# Altium schematic sheet micro.SchDoc
size A3
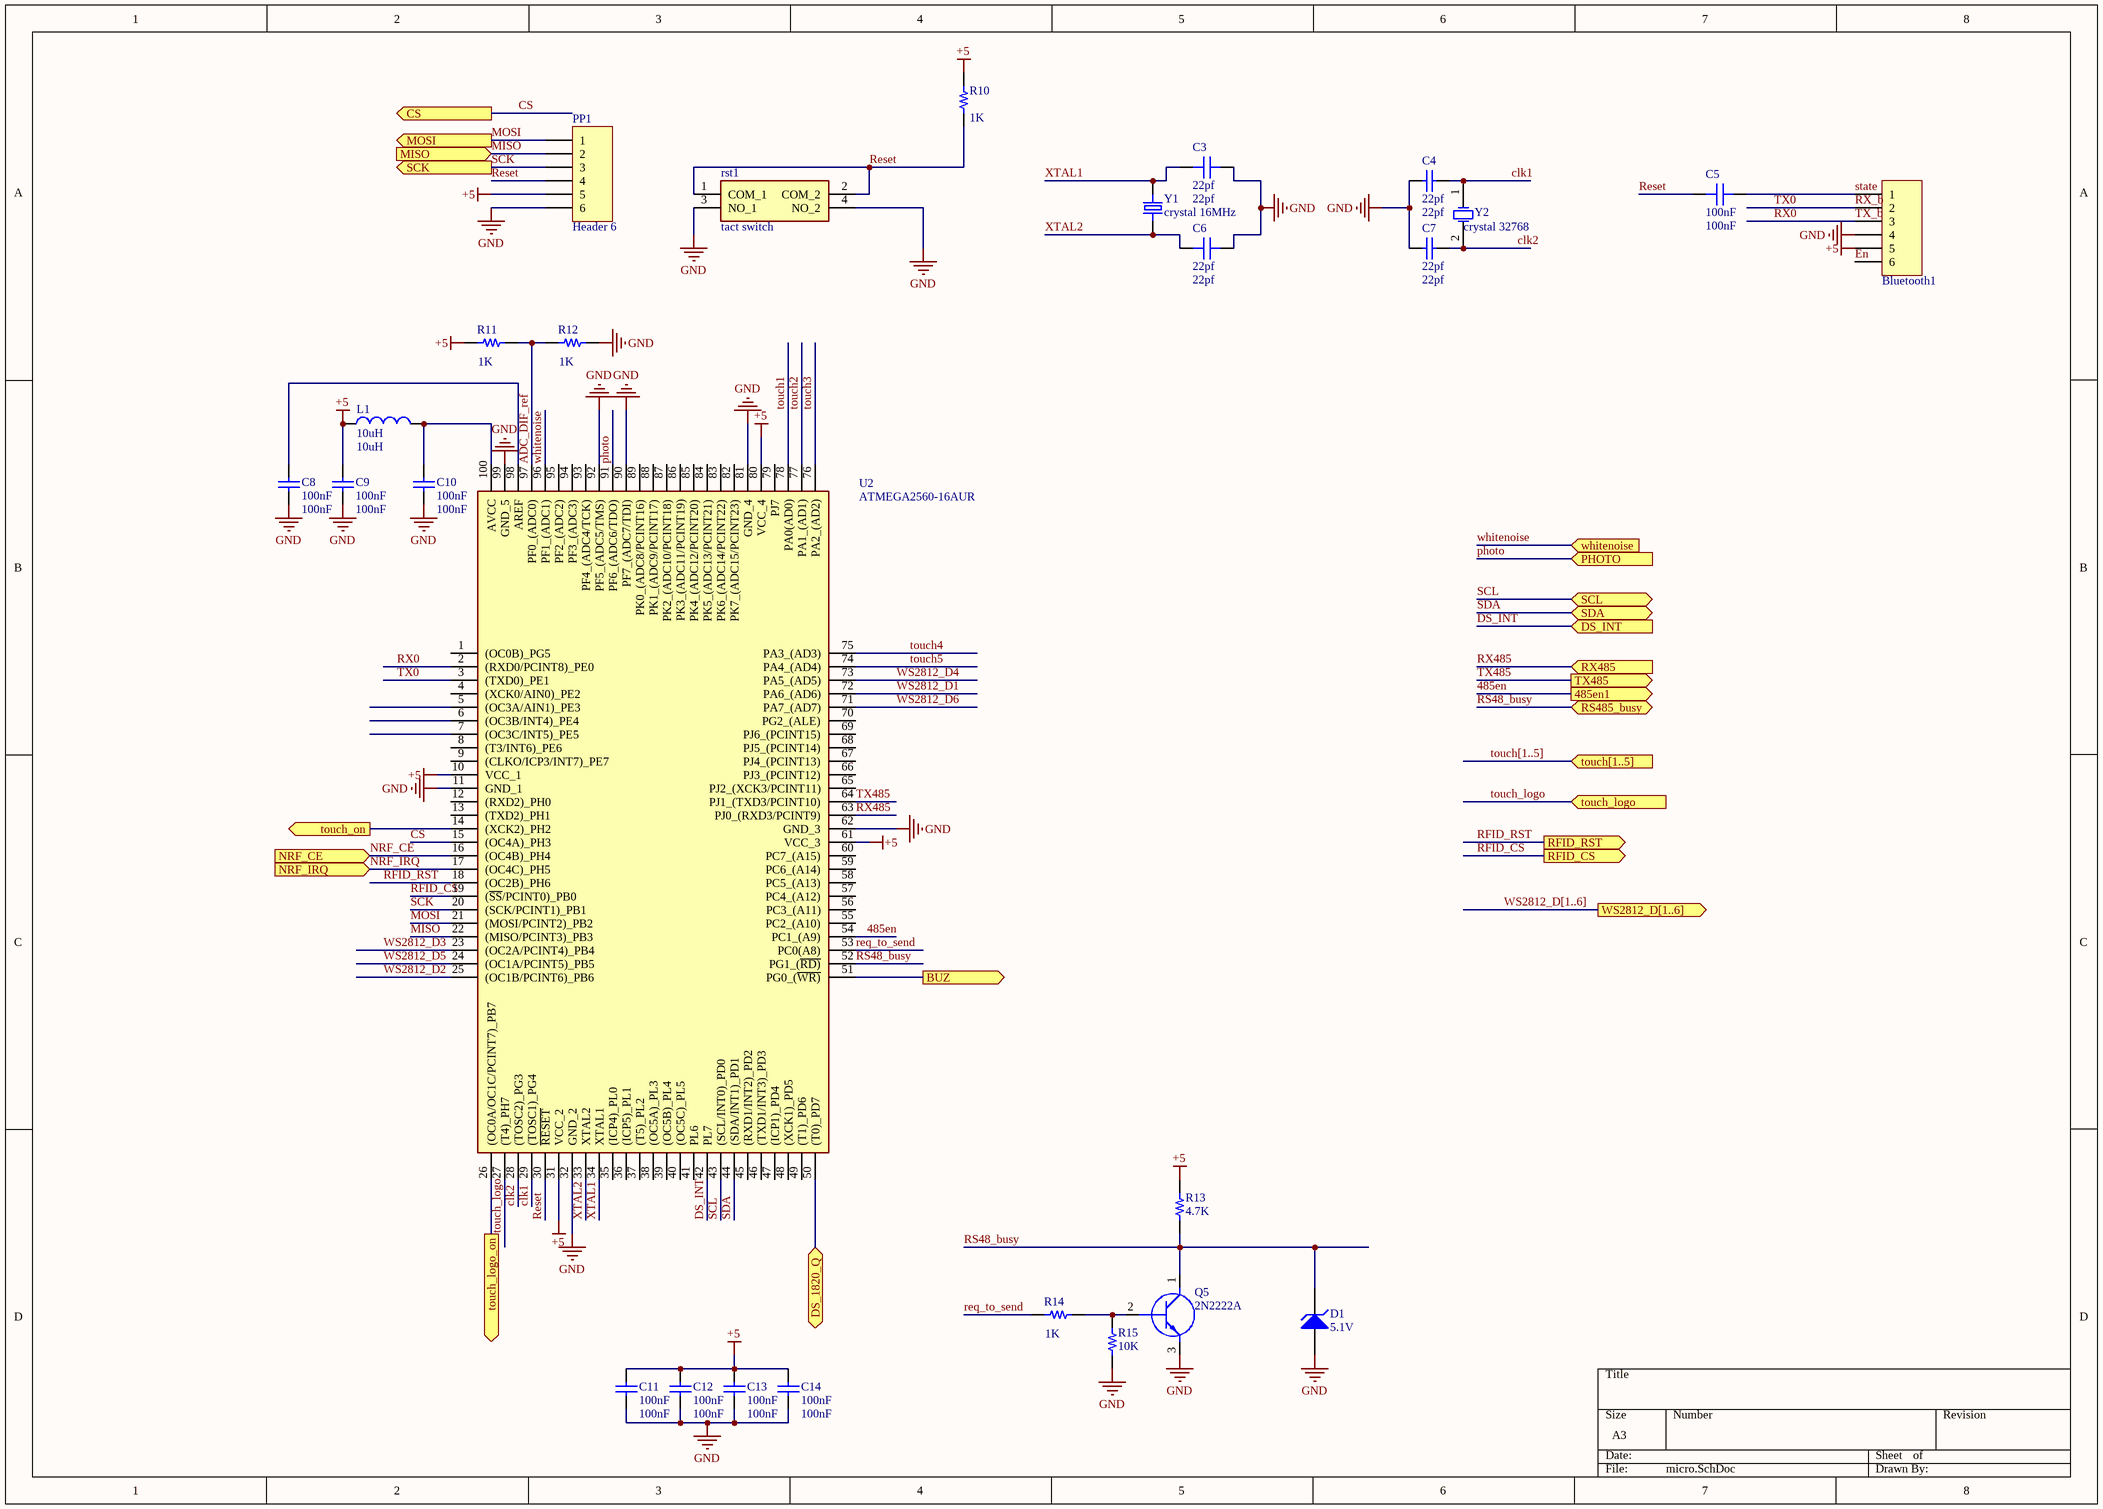
[diagram p0: micro.SchDoc]

## Parts
Bluetooth1  Header 6  [H-1x6]  (value not drawn)
C3  22pf  [0603C]
C4  22pf  [0603C]
C5  100nF  [0603C]
C6  22pf  [0603C]
C7  22pf  [0603C]
C8  100nF  [0603C]
C9  100nF  [0603C]
C10  100nF  [0603C]
C11  100nF  [0603C]
C12  100nF  [0603C]
C13  100nF  [0603C]
C14  100nF  [0603C]
D1  5.1V  [Diode 1n4148 SMD]
L1  10uH  [IND1206]
PP1  Header 6  [HDR1X6]
Q5  2N2222A  [soT95p280x130-3n]
R10  1K  [0603R]
R11  1K  [0603R]
R12  1K  [0603R]
R13  4.7K  [0603R]
R14  1K  [0603R]
R15  10K  [0603R]
rst1  tact switch  [DTSM63NVB]
U2  ATMEGA2560-16AUR  [QFP50P1600X1600X120-100N]
Y1  crystal 16MHz  [XTAL_ECS-180-S-5P-DN-TR]
Y2  crystal 32768  [XTAL RTC]

## Ports
485en1 (out), BUZ (out), CS (out), DS_1820_Q (bidir), DS_INT (in), MISO (in), MOSI (out), NRF_CE (in), NRF_IRQ (in), PHOTO (in), RFID_CS (out), RFID_RST (out), RS485_busy (bidir), RX485 (in), SCK (out), SCL (bidir), SDA (bidir), touch[1..5] (in), touch_logo (in), touch_logo_on (out), touch_on (out), TX485 (out), whitenoise (in), WS2812_D[1..6] (out)

## Nets
+5: Bluetooth1.5 C9.1 C11.1 C12.1 C13.1 C14.1 L1.1 PP1.5 R10.2 R11.2 R13.1 U2.10(VCC_1) U2.31(VCC_2) U2.61(VCC_3) U2.80(VCC_4)
GND: Bluetooth1.4 C3.1 C4.1 C6.1 C7.2 C8.2 C9.2 C10.2 C11.2 C12.2 C13.2 C14.2 D1.1(A) PP1.6 Q5.3(E) R12.1 R15.2 rst1.3(NO_1) rst1.4(NO_2) U2.11(GND_1) U2.32(GND_2) U2.62(GND_3) U2.81(GND_4) U2.90(PF7_(ADC7/TDI)) U2.92(PF5_(ADC5/TMS)) U2.99(GND_5)
485en: U2.54(PC1_(A9)) ; port 485en1
ADC_DIF_ref: R11.1 R12.2 U2.97(PF0_(ADC0))
BUZ: U2.51(PG0_(~{WR)}) ; port BUZ
clk1: C4.2 U2.29((TOSC1)_PG4) Y2.1(OSC1)
clk2: C7.1 U2.28((TOSC2)_PG3) Y2.2(OSC2)
CS: U2.15((OC4A)_PH3) ; port CS
DS_1820_Q: U2.50((T0)_PD7) ; port DS_1820_Q
DS_INT: U2.42(PL7) ; port DS_INT
En: Bluetooth1.6
MISO: PP1.2 U2.22((MISO/PCINT3)_PB3) ; port MISO
MOSI: PP1.1 U2.21((MOSI/PCINT2)_PB2) ; port MOSI
NRF_CE: U2.16((OC4B)_PH4) ; port NRF_CE
NRF_IRQ: U2.17((OC4C)_PH5) ; port NRF_IRQ
photo: U2.91(PF6_(ADC6/TDO)) ; port PHOTO
req_to_send: R14.2 U2.53(PC0(A8))
Reset: C5.2 PP1.4 R10.1 rst1.1(COM_1) rst1.2(COM_2) U2.30(~{RESET})
RFID_CS: U2.19((~{SS}/PCINT0)_PB0) ; port RFID_CS
RFID_RST: U2.18((OC2B)_PH6) ; port RFID_RST
RS48_busy: D1.2(K) Q5.1(C) R13.2 U2.52(PG1_(~{RD)}) ; port RS485_busy
RX0: Bluetooth1.3 U2.2((RXD0/PCINT8)_PE0)  [also labelled TX_b]
RX485: U2.63(PJ0_(RXD3/PCINT9)) ; port RX485
RX_b: Bluetooth1.2 U2.3((TXD0)_PE1)  [also labelled TX0]
SCK: PP1.3 U2.20((SCK/PCINT1)_PB1) ; port SCK
SCL: U2.43((SCL/INT0)_PD0) ; port SCL
SDA: U2.44((SDA/INT1)_PD1) ; port SDA
state: Bluetooth1.1 C5.1
touch1: U2.78(PA0(AD0))
touch2: U2.77(PA1_(AD1))
touch3: U2.76(PA2_(AD2))
touch4: U2.75(PA3_(AD3))
touch5: U2.74(PA4_(AD4))
touch_logo: U2.27((T4)_PH7) ; port touch_logo
touch_logo_on: U2.26((OC0A/OC1C/PCINT7)_PB7) ; port touch_logo_on
touch_on: U2.14((XCK2)_PH2) ; port touch_on
TX485: U2.64(PJ1_(TXD3/PCINT10)) ; port TX485
whitenoise: U2.96(PF1_(ADC1)) ; port whitenoise
WS2812_D1: U2.72(PA6_(AD6))
WS2812_D2: U2.25((OC1B/PCINT6)_PB6)
WS2812_D3: U2.23((OC2A/PCINT4)_PB4)
WS2812_D4: U2.73(PA5_(AD5))
WS2812_D5: U2.24((OC1A/PCINT5)_PB5)
WS2812_D6: U2.71(PA7_(AD7))
XTAL1: C3.2 U2.34(XTAL1) Y1.2
XTAL2: C6.2 U2.33(XTAL2) Y1.1
NetC8_1: C8.1 U2.98(AREF)
NetC10_1: C10.1 L1.2 U2.100(AVCC)
NetQ5_2: Q5.2(B) R14.1 R15.1

Not connected (* = marked no-connect by the designer): U2 1((OC0B)_PG5) 4((XCK0/AIN0)_PE2) 5((OC3A/AIN1)_PE3) 6((OC3B/INT4)_PE4) 7((OC3C/INT5)_PE5) 8((T3/INT6)_PE6) 9((CLKO/ICP3/INT7)_PE7) 12((RXD2)_PH0) 13((TXD2)_PH1) 35((ICP4)_PL0) 36((ICP5)_PL1) 37((T5)_PL2) 38((OC5A)_PL3) 39((OC5B)_PL4) 40((OC5C)_PL5) 41(PL6) 45((RXD1/INT2)_PD2) 46((TXD1/INT3)_PD3) 47((ICP1)_PD4) 48((XCK1)_PD5) 49((T1)_PD6) 55(PC2_(A10)) 56(PC3_(A11)) 57(PC4_(A12)) 58(PC5_(A13)) 59(PC6_(A14)) 60(PC7_(A15)) 65(PJ2_(XCK3/PCINT11)) 66(PJ3_(PCINT12)) 67(PJ4_(PCINT13)) 68(PJ5_(PCINT14)) 69(PJ6_(PCINT15)) 70(PG2_(ALE)) 79(PJ7) 82(PK7_(ADC15/PCINT23)) 83(PK6_(ADC14/PCINT22)) 84(PK5_(ADC13/PCINT21)) 85(PK4_(ADC12/PCINT20)) 86(PK3_(ADC11/PCINT19)) 87(PK2_(ADC10/PCINT18)) 88(PK1_(ADC9/PCINT17)) 89(PK0_(ADC8/PCINT16)) 93(PF4_(ADC4/TCK)) 94(PF3_(ADC3)) 95(PF2_(ADC2))

## Buses and harness runs
bus touch[1..5] = port touch[1..5]
bus WS2812_D[1..6] = port WS2812_D[1..6]

## Library data of the parts
Bluetooth1 = H-1x6: Header, 6-Pin , female
C3 C5 C6 = Capacitor: CAP SMD 0603; Part Number: C0805X106K9RAC7800
  C3 C6: Value: 22pf
  C5: Value: 100nF
C4 C7-C14 = Cap: CAP SMD 0603; Published: 8-Jun-2000; LatestRevisionDate: 17-Jul-2002; LatestRevisionNote: Re-released for DXP Platform.; PackageReference: RAD-0.3; Publisher: Altium Limited; PackageDescription: Radial Cap, Thru-Hole; 2 Leads; 0.3 in Pin Spacing
  C4 C7: Value: 22pf
  C8-C14: Value: 100nF
D1 = D Zener: Zener Diode 5.1v; Published: 8-Jun-2000; LatestRevisionDate: 17-Jul-2002; LatestRevisionNote: Re-released for DXP Platform.; PackageReference: DIODE-0.7; Publisher: Altium Limited; PackageDescription: Diode, Thru-Hole; 2 Leads; 0.7 in Pin Spacing
L1 = Inductor: Inductor 1206; Code_IEC: 1005; Published: 8-Jun-2000; LatestRevisionDate: 29-May-2009; LatestRevisionNote: IPC-7351 Footprint Added.; PackageReference: 0402-A; Publisher: Altium Limited; PackageDescription: Chip Inductor; Code_JEITA: 0402; Value: 10uH
PP1 = Header 6: Header, 6-Pin , female; LatestRevisionDate: 17-Jul-2002; LatestRevisionNote: Re-released for DXP Platform.; Publisher: Altium Limited
Q5 = 2N2222A: Transistor BJT NPN SMD; pin to pad: 1>3 2>1 3>2; Manufacturer_Name: Foshan Blue Rocket Elec; Datasheet Link: https://datasheet.lcsc.com/szlcsc/1901291437_Foshan-Blue-Rocket-Elec-2N2222A_C358533.pdf; Height: 4.7mm; Manufacturer_Part_Number: 2N2222A
R10-R15 = Resistor: RES SMD 0603; Part Number: RCS0805100KFKEA
  R10-R12 R14: Value: 1K
  R13: Value: 4.7K
  R15: Value: 10K
rst1 = DTSM-66R-V-T_R: Push Button SMD - 4PIN; Manufacturer_Name: Diptronics; Manufacturer_Part_Number: DTSM-66R-V-T/R; Datasheet Link: https://www.mouser.co.uk/datasheet/2/910/464_DTSMJ-6-1571536.pdf; Height: 7.1mm; Mouser Part Number: 113-DTSM66RVTR; Mouser Price/Stock: https://www.mouser.co.uk/ProductDetail/Diptronics/DTSM-66R-V-T-R?qs=MLItCLRbWsxl2%252BVY862AIw%3D%3D
U2 = ATMEGA2560-16AUR: ATMEGA2560-LQFP100; Manufacturer_Name: Microchip; Datasheet Link: http://ww1.microchip.com/downloads/en/DeviceDoc/Atmel-2549-8-bit-AVR-Microcontroller-ATmega640-1280-1281-2560-2561_datasheet.pdf; Height: 1.2mm; Manufacturer_Part_Number: ATMEGA2560-16AUR; Mouser Part Number: 556-ATMEGA2560-16AUR; Mouser Price/Stock: https://www.mouser.co.uk/ProductDetail/Microchip-Technology-Atmel/ATMEGA2560-16AUR?qs=6Dg1WZIWLC5tcX5fO8xzXQ%3D%3D; Arrow Part Number: ATMEGA2560-16AUR; Arrow Price/Stock: https://www.arrow.com/en/products/atmega2560-16aur/microchip-technology?region=nac
Y1 = ECS-180-S-5P-DN-TR: Crystals 16MHz; MF: ECS International; MP: ECS-180-S-5P-DN-TR; Value: 16MHz; SnapEDA_Link: https://www.snapeda.com/parts/ECS-180-S-5P-DN-TR/ECS%20International/view-part/2547669/?ref=snap; Price: None; Package: HC49/US ECS International; Availability: Unavailable
Y2 = XTAL: RTC crystal; Company: E.P.I.L; Value: 32768; Design Date: 11/04/2011